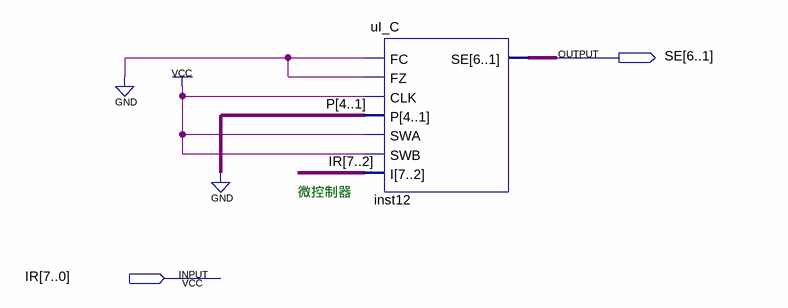
[diagram p0: schematic sheet]
// Quartus schematic uPC22.bdf as structural Verilog: 1 symbols, 2 pins
module uPC22 (
  input  [7:0] IR,
  output [6:1] SE
);

  uI_C inst12 (.FC(1'b0), .FZ(1'b0), .CLK(1'b1), .P(4'b0000), .SWA(1'b1), .SWB(1'b1), .I(IR[7:2]), .SE(SE));

  // Notes on the sheet:
  //   微控制器
endmodule
